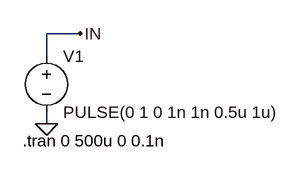
[diagram p0: schematic PWM Input.asc]
PWM Input.asc, the LTspice schematic file:
Version 4
SHEET 1 880 680
WIRE 64 160 16 160
WIRE 16 192 16 160
WIRE 16 288 16 272
FLAG 16 288 0
FLAG 64 160 IN
SYMBOL voltage 16 176 R0
WINDOW 123 0 0 Left 0
WINDOW 39 0 0 Left 0
SYMATTR InstName V1
SYMATTR Value PULSE(0 1 0 1n 1n 0.5u 1u)
TEXT -18 312 Left 2 !.tran 0 500u 0 0.1n

The netlist it stands for:
* PWM Input.asc
V1 IN 0 PULSE(0 1 0 1n 1n 0.5u 1u)
.tran 0 500u 0 0.1n
.backanno
.end